# Altium project Toilet Timer.PrjPcb
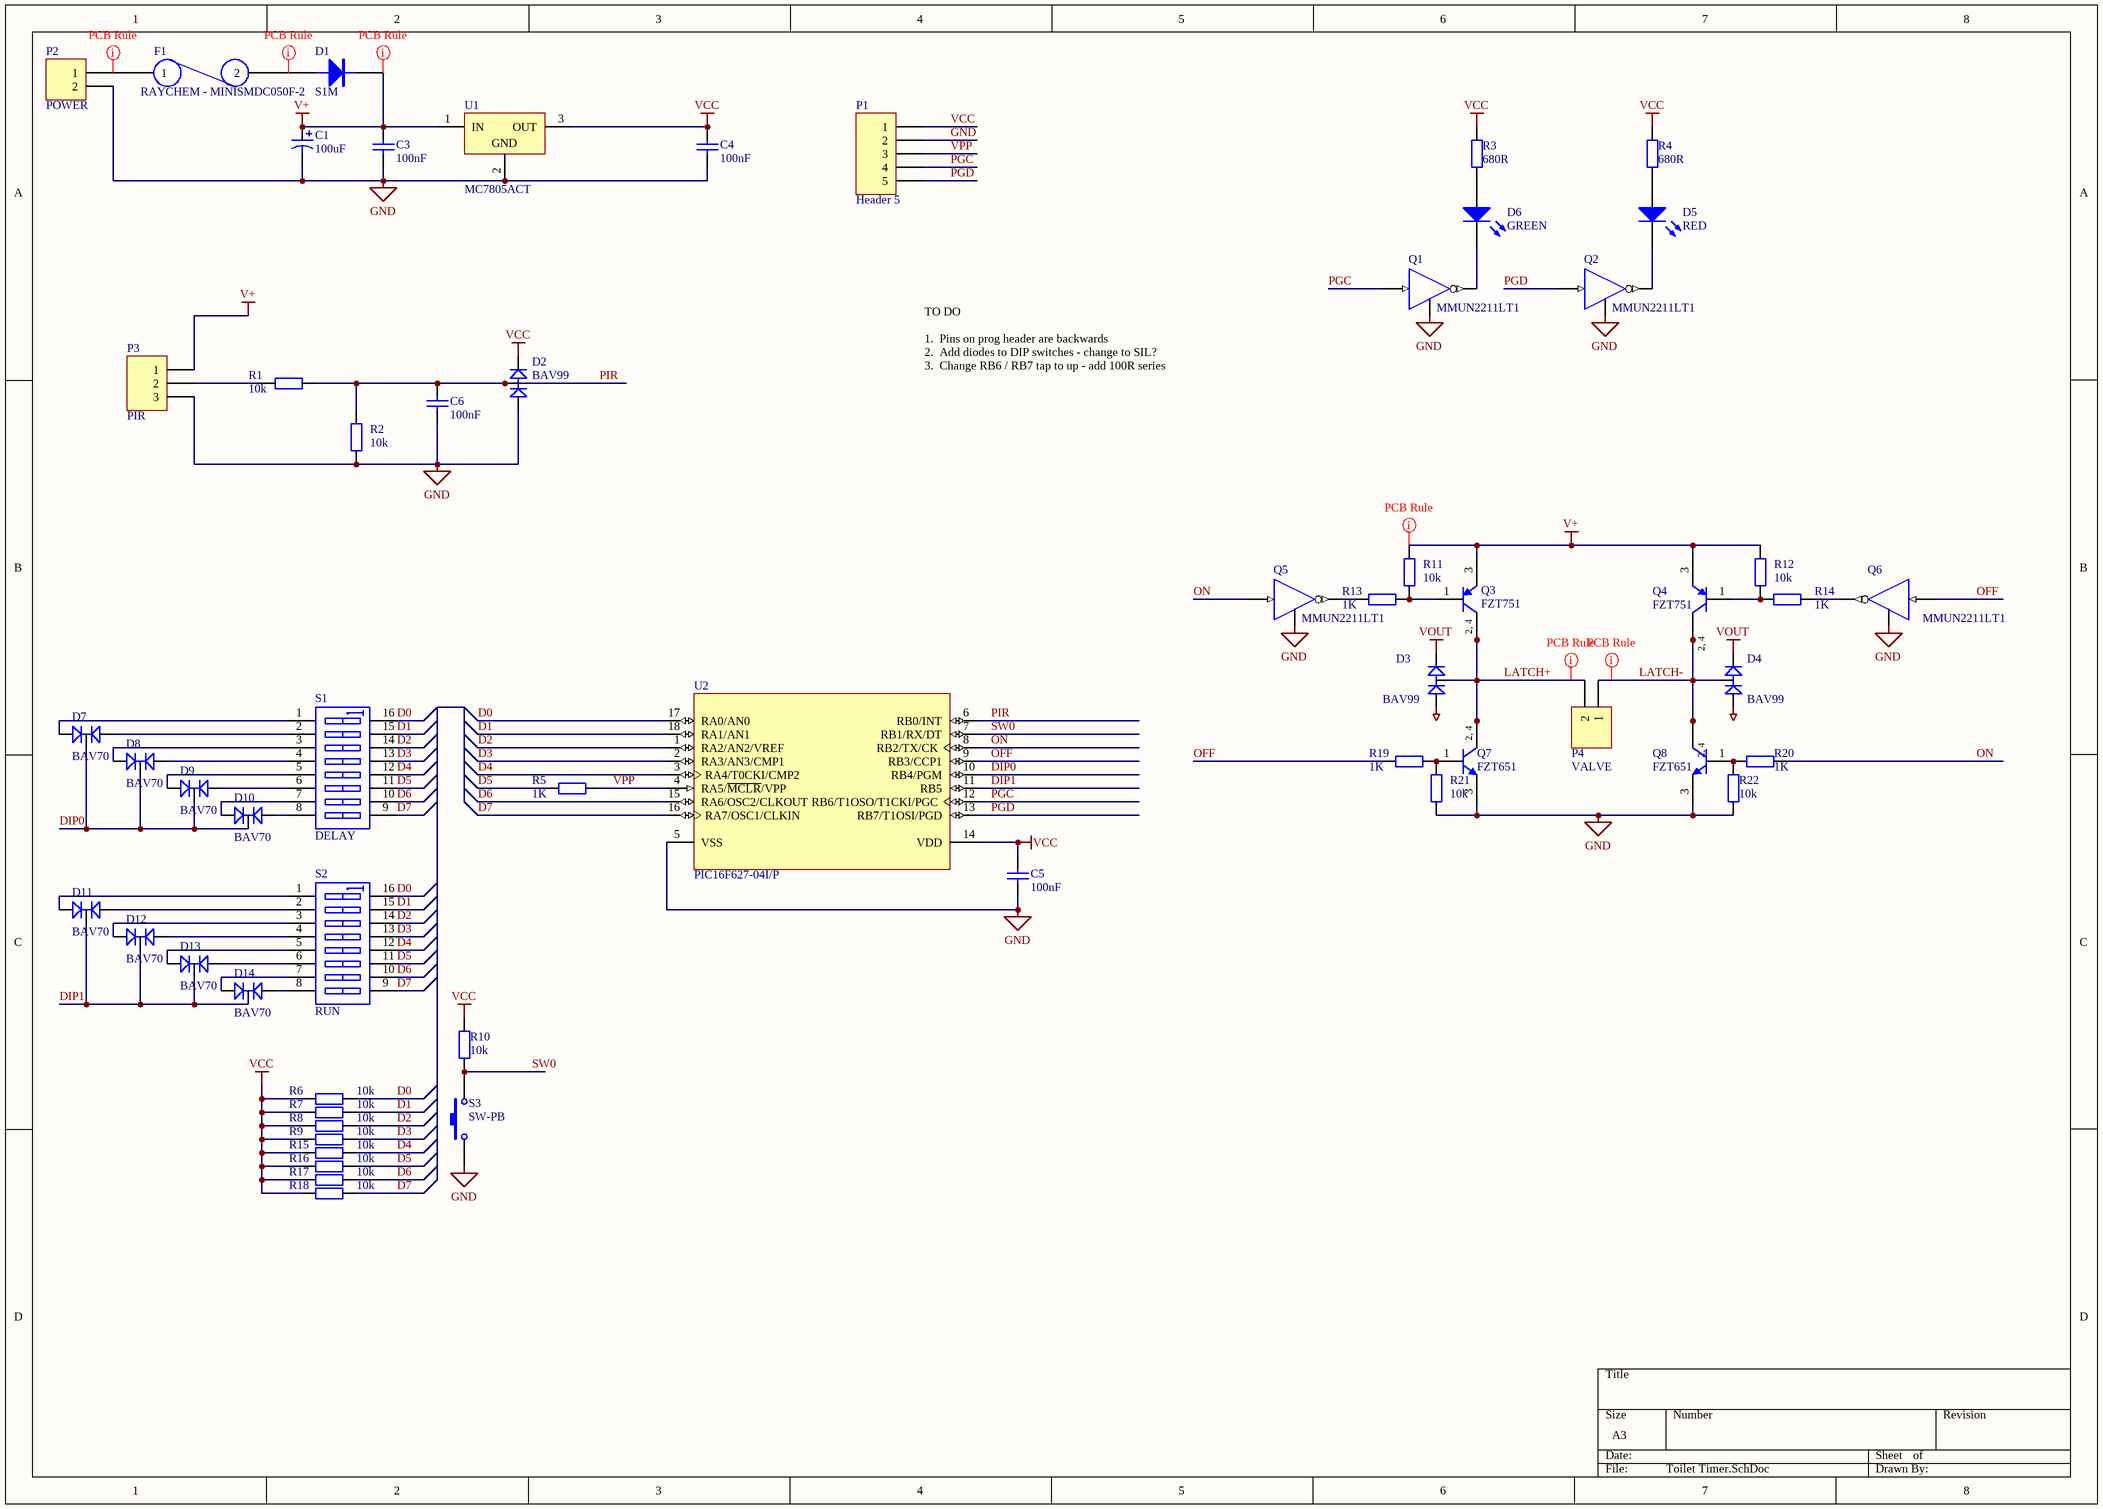
[diagram p0: Toilet Timer.SchDoc]
1 sheet, 59 parts. Net scope: global (net labels, ports and power ports of the same name join across sheets).
Board file: TT 3D Model (SMALL).PcbDoc

## Sheet Toilet Timer.SchDoc
size A3

### Parts
C1  value 100uF  [CAP, SMD E CASE]  (hidden comment: Cap Pol1)
C3  value 100nF  [CAP(3D) - 0805]  (hidden comment: Cap)
C4  value 100nF  [CAP(3D) - 0805]  (hidden comment: Cap)
C5  value 100nF  [CAP(3D) - 0805]  (hidden comment: Cap)
C6  value 100nF  [CAP(3D) - 0805]  (hidden comment: Cap)
D1  S1M  [DO-214AC]
D2  BAV99  [SOT23-3L]
D3  BAV99  [SOT23-3L]
D4  BAV99  [SOT23-3L]
D5  RED  [LED(3D) RED - 0805]
D6  GREEN  [LED(3D) GREEN - 0805]
D7  BAV70  [SOT23-3L]
D8  BAV70  [SOT23-3L]
D9  BAV70  [SOT23-3L]
D10  BAV70  [SOT23-3L]
D11  BAV70  [SOT23-3L]
D12  BAV70  [SOT23-3L]
D13  BAV70  [SOT23-3L]
D14  BAV70  [SOT23-3L]
F1  RAYCHEM - MINISMDC050F-2  [miniSMD Polyswitch]
P1  Header 5  [TERMINAL-6 POL]
P2  POWER  [TYCO  1776112-2]
P3  PIR  [TYCO  1776112-3]
P4  VALVE  [TYCO  1776112-2]
Q1  MMUN2211LT1  [SOT23-3L]
Q2  MMUN2211LT1  [SOT23-3L]
Q3  FZT751  [SOT223]
Q4  FZT751  [SOT223]
Q5  MMUN2211LT1  [SOT23-3L]
Q6  MMUN2211LT1  [SOT23-3L]
Q7  FZT651  [SOT223]
Q8  FZT651  [SOT223]
R1  value 10k  [RES(3D) - 0805]  (hidden comment: Res2)
R2  value 10k  [RES(3D) - 0805]  (hidden comment: Res2)
R3  value 680R  [RES(3D) - 0805]  (hidden comment: Res2)
R4  value 680R  [RES(3D) - 0805]  (hidden comment: Res2)
R5  value 1K  [RES(3D) - 0805]  (hidden comment: Res2)
R6  value 10k  [RES(3D) - 0805]  (hidden comment: Res2)
R7  value 10k  [RES(3D) - 0805]  (hidden comment: Res2)
R8  value 10k  [RES(3D) - 0805]  (hidden comment: Res2)
R9  value 10k  [RES(3D) - 0805]  (hidden comment: Res2)
R10  value 10k  [RES(3D) - 0805]  (hidden comment: Res2)
R11  value 10k  [RES(3D) - 0805]  (hidden comment: Res2)
R12  value 10k  [RES(3D) - 0805]  (hidden comment: Res2)
R13  value 1K  [RES(3D) - 0805]  (hidden comment: Res2)
R14  value 1K  [RES(3D) - 0805]  (hidden comment: Res2)
R15  value 10k  [RES(3D) - 0805]  (hidden comment: Res2)
R16  value 10k  [RES(3D) - 0805]  (hidden comment: Res2)
R17  value 10k  [RES(3D) - 0805]  (hidden comment: Res2)
R18  value 10k  [RES(3D) - 0805]  (hidden comment: Res2)
R19  value 1K  [RES(3D) - 0805]  (hidden comment: Res2)
R20  value 1K  [RES(3D) - 0805]  (hidden comment: Res2)
R21  value 10k  [RES(3D) - 0805]  (hidden comment: Res2)
R22  value 10k  [RES(3D) - 0805]  (hidden comment: Res2)
S1  DELAY  [S-DIP-16]
S2  RUN  [S-DIP-16]
S3  SW-PB  [TACT 6MM]
U1  MC7805ACT  [7805 - DPAK]
U2  PIC16F627-04I/P  [SOIC-18]

### Nets
GND: C1.2 C3.1 C4.1 C5.1 C6.1 D2.1(A1) D3.1(A1) D4.1(A1) P1.2 P2.2 P3.3 Q1.2(E) Q2.2(E) Q5.2(E) Q6.2(E) Q7.3(E) Q8.3(E) R2.1 R21.1 R22.1 S3.1 U1.2(GND) U2.5(VSS)
V+: C1.1 C3.2 D1.2(K) P3.1 Q3.3(E) Q4.3(E) R11.2 R12.2 U1.1(IN)
VCC: C4.2 C5.2 D2.2(C2) P1.1 R3.2 R4.2 R6.2 R7.2 R8.2 R9.2 R10.1 R15.2 R16.2 R17.2 R18.2 U1.3(OUT) U2.14(VDD)
VOUT: D3.2(C2) D4.2(C2)
D0: R6.1 S1.16(B1) S2.16(B1) U2.17(RA0/AN0)
D1: R7.1 S1.15(B2) S2.15(B2) U2.18(RA1/AN1)
D2: R8.1 S1.14(B3) S2.14(B3) U2.1(RA2/AN2/VREF)
D3: R9.1 S1.13(B4) S2.13(B4) U2.2(RA3/AN3/CMP1)
D4: R15.1 S1.12(B5) S2.12(B5) U2.3(RA4/T0CKI/CMP2)
D5: R5.1 R16.1 S1.11(B6) S2.11(B6)
D6: R17.1 S1.10(B7) S2.10(B7) U2.15(RA6/OSC2/CLKOUT)
D7: R18.1 S1.9(B8) S2.9(B8) U2.16(RA7/OSC1/CLKIN)
DIP0: D7.3(C) D8.3(C) D9.3(C) D10.3(C) U2.10(RB4/PGM)
DIP1: D11.3(C) D12.3(C) D13.3(C) D14.3(C) U2.11(RB5)
LATCH+: D3.3(C1/A2) P4.2 Q3.2(C) Q3.4(C) Q7.2(C) Q7.4(C)
LATCH-: D4.3(C1/A2) P4.1 Q4.2(C) Q4.4(C) Q8.2(C) Q8.4(C)
OFF: Q6.1(B) R19.1 U2.9(RB3/CCP1)
ON: Q5.1(B) R20.1 U2.8(RB2/TX/CK)
PGC: P1.4 Q1.1(B) U2.12(RB6/T1OSO/T1CKI/PGC)
PGD: P1.5 Q2.1(B) U2.13(RB7/T1OSI/PGD)
PIR: C6.2 D2.3(C1/A2) R1.2 R2.2 U2.6(RB0/INT)
SW0: R10.2 S3.2 U2.7(RB1/RX/DT)
VPP: P1.3 R5.2 U2.4(RA5/~{MCLR}/VPP)
NetD1_1: D1.1(A) F1.2
NetD5_1: D5.1(A) R4.1
NetD5_2: D5.2(K) Q2.3(C)
NetD6_1: D6.1(A) R3.1
NetD6_2: D6.2(K) Q1.3(C)
NetD7_1: D7.1(A1) S1.2(A2)
NetD7_2: D7.2(A2) S1.1(A1)
NetD8_1: D8.1(A1) S1.4(A4)
NetD8_2: D8.2(A2) S1.3(A3)
NetD9_1: D9.1(A1) S1.6(A6)
NetD9_2: D9.2(A2) S1.5(A5)
NetD10_1: D10.1(A1) S1.8(A8)
NetD10_2: D10.2(A2) S1.7(A7)
NetD11_1: D11.1(A1) S2.2(A2)
NetD11_2: D11.2(A2) S2.1(A1)
NetD12_1: D12.1(A1) S2.4(A4)
NetD12_2: D12.2(A2) S2.3(A3)
NetD13_1: D13.1(A1) S2.6(A6)
NetD13_2: D13.2(A2) S2.5(A5)
NetD14_1: D14.1(A1) S2.8(A8)
NetD14_2: D14.2(A2) S2.7(A7)
NetF1_1: F1.1 P2.1
NetP3_2: P3.2 R1.1
NetQ3_1: Q3.1(B) R11.1 R13.2
NetQ4_1: Q4.1(B) R12.1 R14.2
NetQ5_3: Q5.3(C) R13.1
NetQ6_3: Q6.3(C) R14.1
NetQ7_1: Q7.1(B) R19.2 R21.2
NetQ8_1: Q8.1(B) R20.2 R22.2

### Layout directives
rule Width Constraint [Pref Width = 50mil    Min Width = 20mil    Max Width = 250mil]: LATCH+, LATCH-, NetD1_1, NetF1_1, V+

### Notes on the sheet
- TO DO
  1.  Pins on prog header are backwards
  2.  Add diodes to DIP switches - change to SIL?
  3.  Change RB6 / RB7 tap to up - add 100R series
- (in symbol FZT651) 2, 4
- (in symbol FZT751) 2, 4

### Library data of the parts
C1 = Cap Pol1: Polarized Capacitor (Radial); Mouser Part No.: 647-UVR1H101MPD1TA
C3-C6 = Cap: Capacitor; Mouser Part No.: K104Z15Y5VE5TH5
D1 = DIODE: DIODE, POWER; Manufacturer: Taiwan Semiconductor; Mouser Part no.: 821-S1M; Farnell Part no.: 9843841; Manufacturer Part No.: S1M; Web link: http://au.mouser.com/ProductDetail/Taiwan-Semiconductor/S1M/?qs=sGAEpiMZZMtEwUVCuofpuOlSmRjzJonf%252bmrIm0%252bGbjE%3d
D2-D4 = BAV99: DUAL DIODE, BAV99; Manufacturer: FAIRCHILD SEMICONDUCTOR; Mouser Part no.: 771-BAV99/T3; Farnell Part no.: 9843612; Manufacturer Part No.: BAV99; PackageReference: SOT-23; value: BAV99; Web link: http://au.mouser.com/ProductDetail/NXP/BAV99-T3/?qs=84A%2fDAdkstK527JD1pwcnQ%3d%3d
D5 = LED0: Typical INFRARED GaAs LED; Value: 5mm RED; Mouser Part No.: 606-4308H1
D6 = LED0: Typical INFRARED GaAs LED; Value: 5mm GREEN; Mouser Part No.: 606-4308H5
D7-D14 = BAV70: DUAL DIODE, BAV99; Manufacturer: FAIRCHILD SEMICONDUCTOR; Farnell Part no.: 9843612; Manufacturer Part No.: BAV99; PackageReference: SOT-23; value: BAV99; Web link: http://au.mouser.com/ProductDetail/NXP/BAV99-T3/?qs=84A%2fDAdkstK527JD1pwcnQ%3d%3d
F1 = POLYSWITCH: Manufacturer: Tyco Electronics / Raychem; Mouser Part no.: 650-MINISMDC050F-2; Farnell Part no.: 1175839; Manufacturer Part No.: MINISMDC050F-2; Web link: http://au.mouser.com/ProductDetail/Tyco-Electronics/MINISMDC050F-2/?qs=k5V78Jg%2feq42japyR7WJvA%3d%3d
P1 = Header 5: Header, 5-Pin; Value: TYCO 640456-5; Mouser Part No.: 571-6404565
P2 P4 = Header 2: Header, 2-Pin; LatestRevisionDate: 17-Jul-2002; LatestRevisionNote: Re-released for DXP Platform.; Publisher: Altium Limited
P3 = Header 3: Header, 3-Pin; LatestRevisionDate: 17-Jul-2002; LatestRevisionNote: Re-released for DXP Platform.; Publisher: Altium Limited
Q1 Q2 Q5 Q6 = NPN DIGITAL TRANSISTOR: Manufacturer: ON Semiconductor; Manufacturer Part No.: MMUN2211LT1G; Mouser Part no.: 863-MMUN2211LT1G; Farnell Part no.: 9556648RL; Web link: http://au.mouser.com/ProductDetail/ON-Semiconductor/MMUN2211LT1G/?qs=ZpPixqFcBtxv5UXtkbhqPw%3d%3d
Q3 Q4 = FZT751: SOT223 PNP Silicon Planar High-Performance Transistor; Published: 8-Jun-2000; LatestRevisionDate: 21-May-2003; LatestRevisionNote: PCB Footprint 'DSO-G3/D7' Renamed.; DatasheetVersion: Feb-1995; PackageVersion: 2002; PackageReference: SOT223; Publisher: Altium Limited; PackageDescription: SOT-223/SC-73; 4 Leads; Body 6.7 x 7.3 mm, inc. leads (LxW max); Code_JEDEC: TO-261-AA-B; ComponentLink1Description: Manufacturer Link; ComponentLink1URL: http://www.zetex.com/; ComponentLink2Description: Datasheet; ComponentLink2URL: www.zetex.com/3.0/pdf/FZT751.pdf
Q7 Q8 = FZT651: SOT223 NPN Silicon Planar High-Performance Transistor; Published: 8-Jun-2000; LatestRevisionDate: 21-May-2003; LatestRevisionNote: PCB Footprint 'DSO-G3/D7' Renamed.; DatasheetVersion: Feb-1995; PackageVersion: 2002; PackageReference: SOT223; Publisher: Altium Limited; PackageDescription: SOT-223/SC-73; 4 Leads; Body 6.7 x 7.3 mm, inc. leads (LxW max); Code_JEDEC: TO-261-AA-B; ComponentLink1Description: Manufacturer Link; ComponentLink1URL: http://www.zetex.com/; ComponentLink2Description: Datasheet; ComponentLink2URL: www.zetex.com/3.0/pdf/FZT651.pdf
R1-R22 = Res2: Resistor
  R1 R2 R6-R12 R15-R18 R21 R22: Mouser Part No.: 660-MF1/4LCT52R103J
  R3 R4: Mouser Part No.: 660-MF1/4DCT52R6800F
  R5 R13 R14 R19 R20: Mouser Part No.: 660-MF1/4DCT52R1102F
S1 S2 = SW DIP-8: DIP Switch, 8 Position, SPST; Value: DIP8; Mouser Part No.: 774-2068
S3 = SW-PB: Switch; Value: 6mm TACT; Mouser Part No.: 642-MJTP1230
U1 = MC7805ACT: 3-Terminal Positive Fixed Voltage Regulator; Value: LM7805ACT; Mouser Part No.: 512-LM7805ACT
U2 = PIC16F627-04I/P: FLASH-Based 8-Bit CMOS Microcontroller, 1K (x14-Bit words) FLASH, 224 Bytes RAM, 4 MHz, 18-Pin PDIP, 3.0 to 5.5V Supply Range, Industrial Temperature; Value: PIC16F627A-I/P; Mouser Part No.: 579-PIC16F627A-I/P